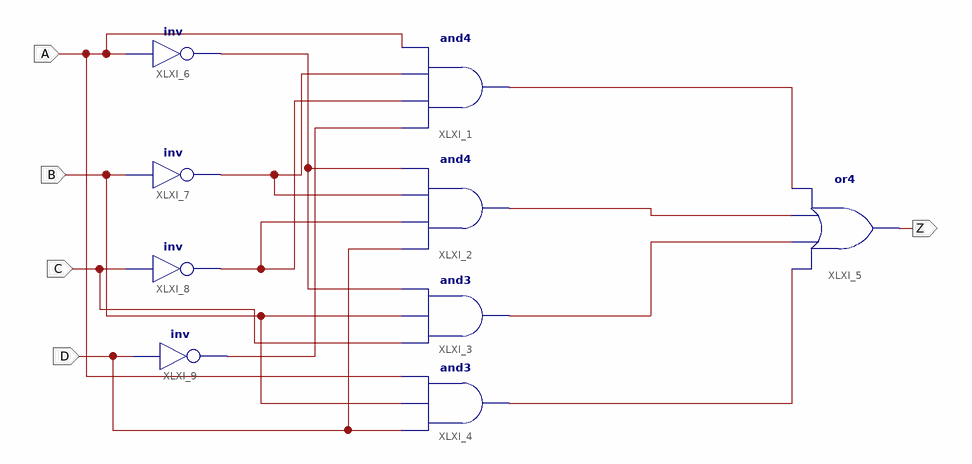
[diagram p0: schematic sheet 1]
// Xilinx ISE schematic p1ej1a.sch (spartan3) as structural Verilog: 9 symbols, 5 ports
module p1ej1a (
  input  A,
  input  B,
  input  C,
  input  D,
  output Z
);

  wire XLXN_1, XLXN_2, XLXN_3, XLXN_4, XLXN_6, XLXN_8, XLXN_10, XLXN_11;

  and XLXI_1 (XLXN_1, XLXN_11, XLXN_10, XLXN_8, A);
  and XLXI_2 (XLXN_2, D, XLXN_10, XLXN_8, XLXN_6);
  and XLXI_3 (XLXN_3, C, B, XLXN_6);
  and XLXI_4 (XLXN_4, D, B, A);
  or XLXI_5 (Z, XLXN_4, XLXN_3, XLXN_2, XLXN_1);
  not XLXI_6 (XLXN_6, A);
  not XLXI_7 (XLXN_8, B);
  not XLXI_8 (XLXN_10, C);
  not XLXI_9 (XLXN_11, D);
endmodule
